# Altium project MB1842.PrjPcb
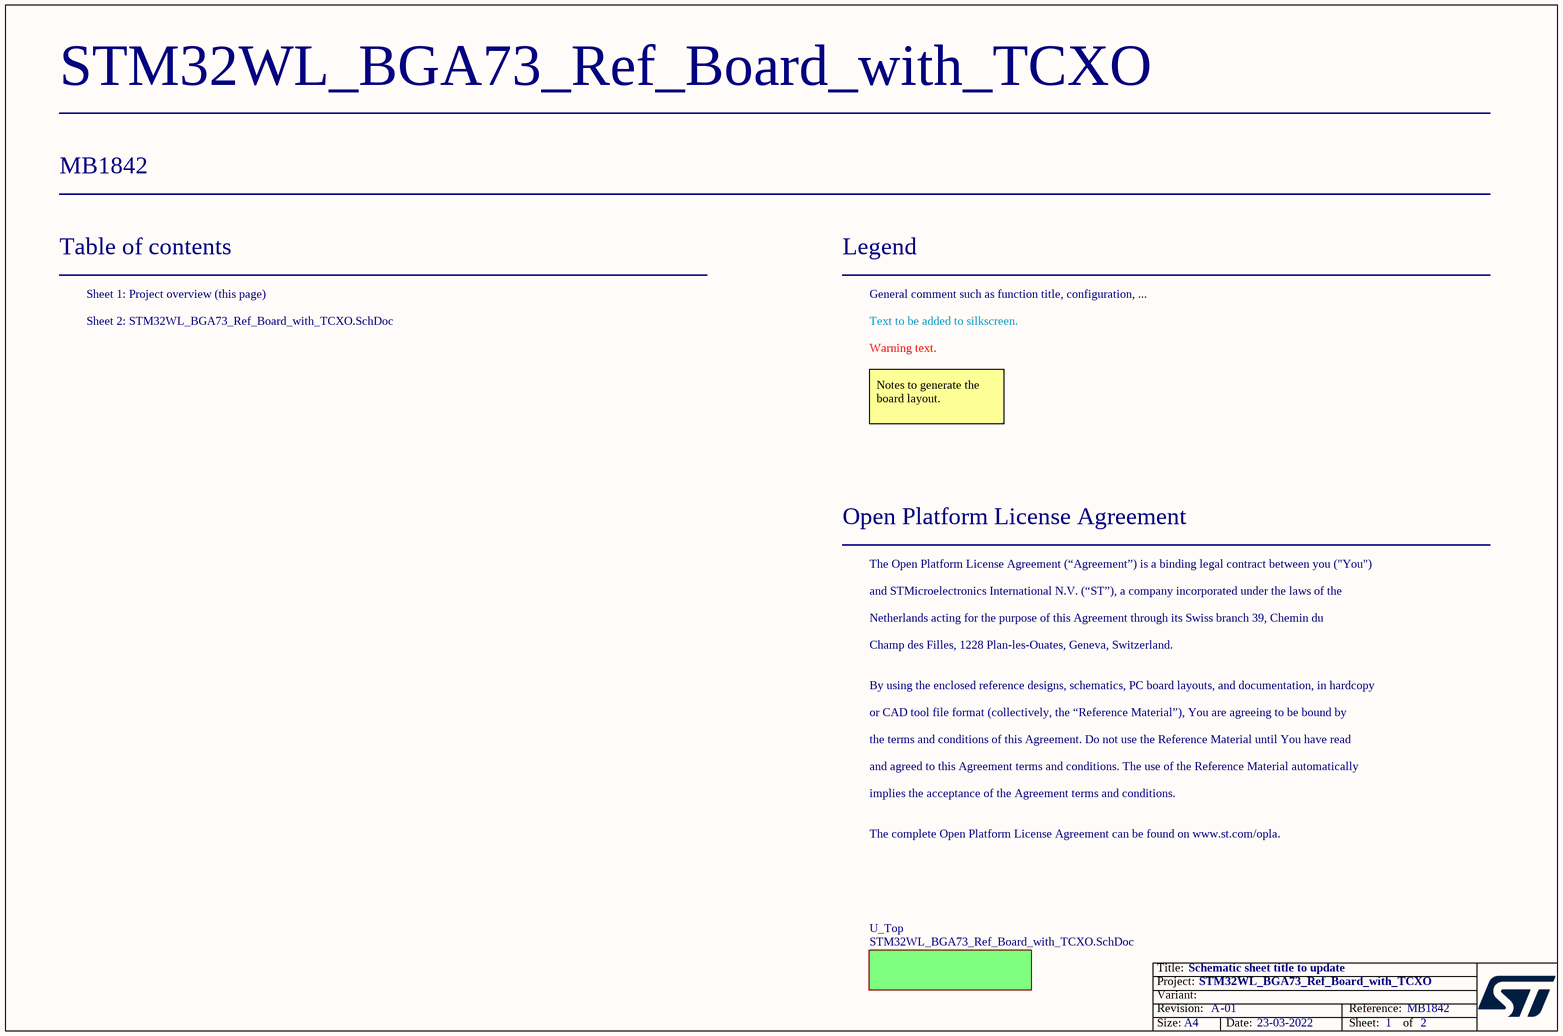
[diagram p0: Project_Overview.SchDoc]
Board_Assembly_Revision: 01; Board_Document_Date: 23-03-2022; Board_Name: STM32WL_BGA73_Ref_Board_with_TCXO; Board_PCB_Revision: A; Board_Reference: MB1842
2 sheets, 78 parts. Net scope: flat (ports and power ports of the same name join across sheets).
Board file: MB1842.PcbDoc
Sheets:
  Project_Overview.SchDoc
    U_Top = STM32WL_BGA73_Ref_Board_with_TCXO.SchDoc

## Sheet Project_Overview.SchDoc: Schematic sheet title to update
size A4; Date: Not used; ApprovedBy: Not used; CheckedBy: Not used; Author: Not used; CompanyName: STMicroelectronics; DrawnBy: Not used; Engineer: Not used; Organization: Not used; Address1: Not used; Address2: Not used; Address3: Not used; Address4: Not used; DocumentNumber: Not used; Revision: Not used; SheetNumber: 1; SheetTotal: 2; CurrentTime: Not used; CurrentDate: Not used; Time: Not used; DocumentFullPathAndName: Not used; DocumentName: Not used; ModifiedDate: Not used; ImagePath: Not used; ProjectName: Not used; Application_BuildNumber: Not used

### Sub-sheets
U_Top = STM32WL_BGA73_Ref_Board_with_TCXO.SchDoc: no entries

### Notes on the sheet
- Table of contents
- Sheet 1: Project overview (this page)
- Legend
- General comment such as function title, configuration, ...
- Sheet 2: STM32WL_BGA73_Ref_Board_with_TCXO.SchDoc
- Text to be added to silkscreen.
- Warning text.
- Notes to generate the board layout.
- Open Platform License Agreement
- The Open Platform License Agreement (“Agreement”) is a binding legal contract between you ("You")
- and STMicroelectronics International N.V. (“ST”), a company incorporated under the laws of the
- Netherlands acting for the purpose of this Agreement through its Swiss branch 39, Chemin du
- Champ des Filles, 1228 Plan-les-Ouates, Geneva, Switzerland.
- By using the enclosed reference designs, schematics, PC board layouts, and documentation, in hardcopy
- or CAD tool file format (collectively, the “Reference Material”), You are agreeing to be bound by
- the terms and conditions of this Agreement. Do not use the Reference Material until You have read
- and agreed to this Agreement terms and conditions. The use of the Reference Material automatically
- implies the acceptance of the Agreement terms and conditions.
- The complete Open Platform License Agreement can be found on www.st.com/opla.
- Title:
- Project:
- Size:
- Revision:
- Variant:
- A4
- -
- Date:
- Reference:
- Sheet:
- of

## Sheet STM32WL_BGA73_Ref_Board_with_TCXO.SchDoc: Schematic sheet title to update
size A3; Date: Not used; ApprovedBy: Not used; CheckedBy: Not used; Author: Not used; CompanyName: STMicroelectronics; DrawnBy: Not used; Engineer: Not used; Organization: Not used; Address1: Not used; Address2: Not used; Address3: Not used; Address4: Not used; DocumentNumber: Not used; Revision: Not used; SheetNumber: 2; SheetTotal: 2; CurrentTime: Not used; CurrentDate: Not used; Time: Not used; DocumentFullPathAndName: Not used; DocumentName: Not used; ModifiedDate: Not used; ImagePath: Not used; ProjectName: Not used; Application_BuildNumber: Not used
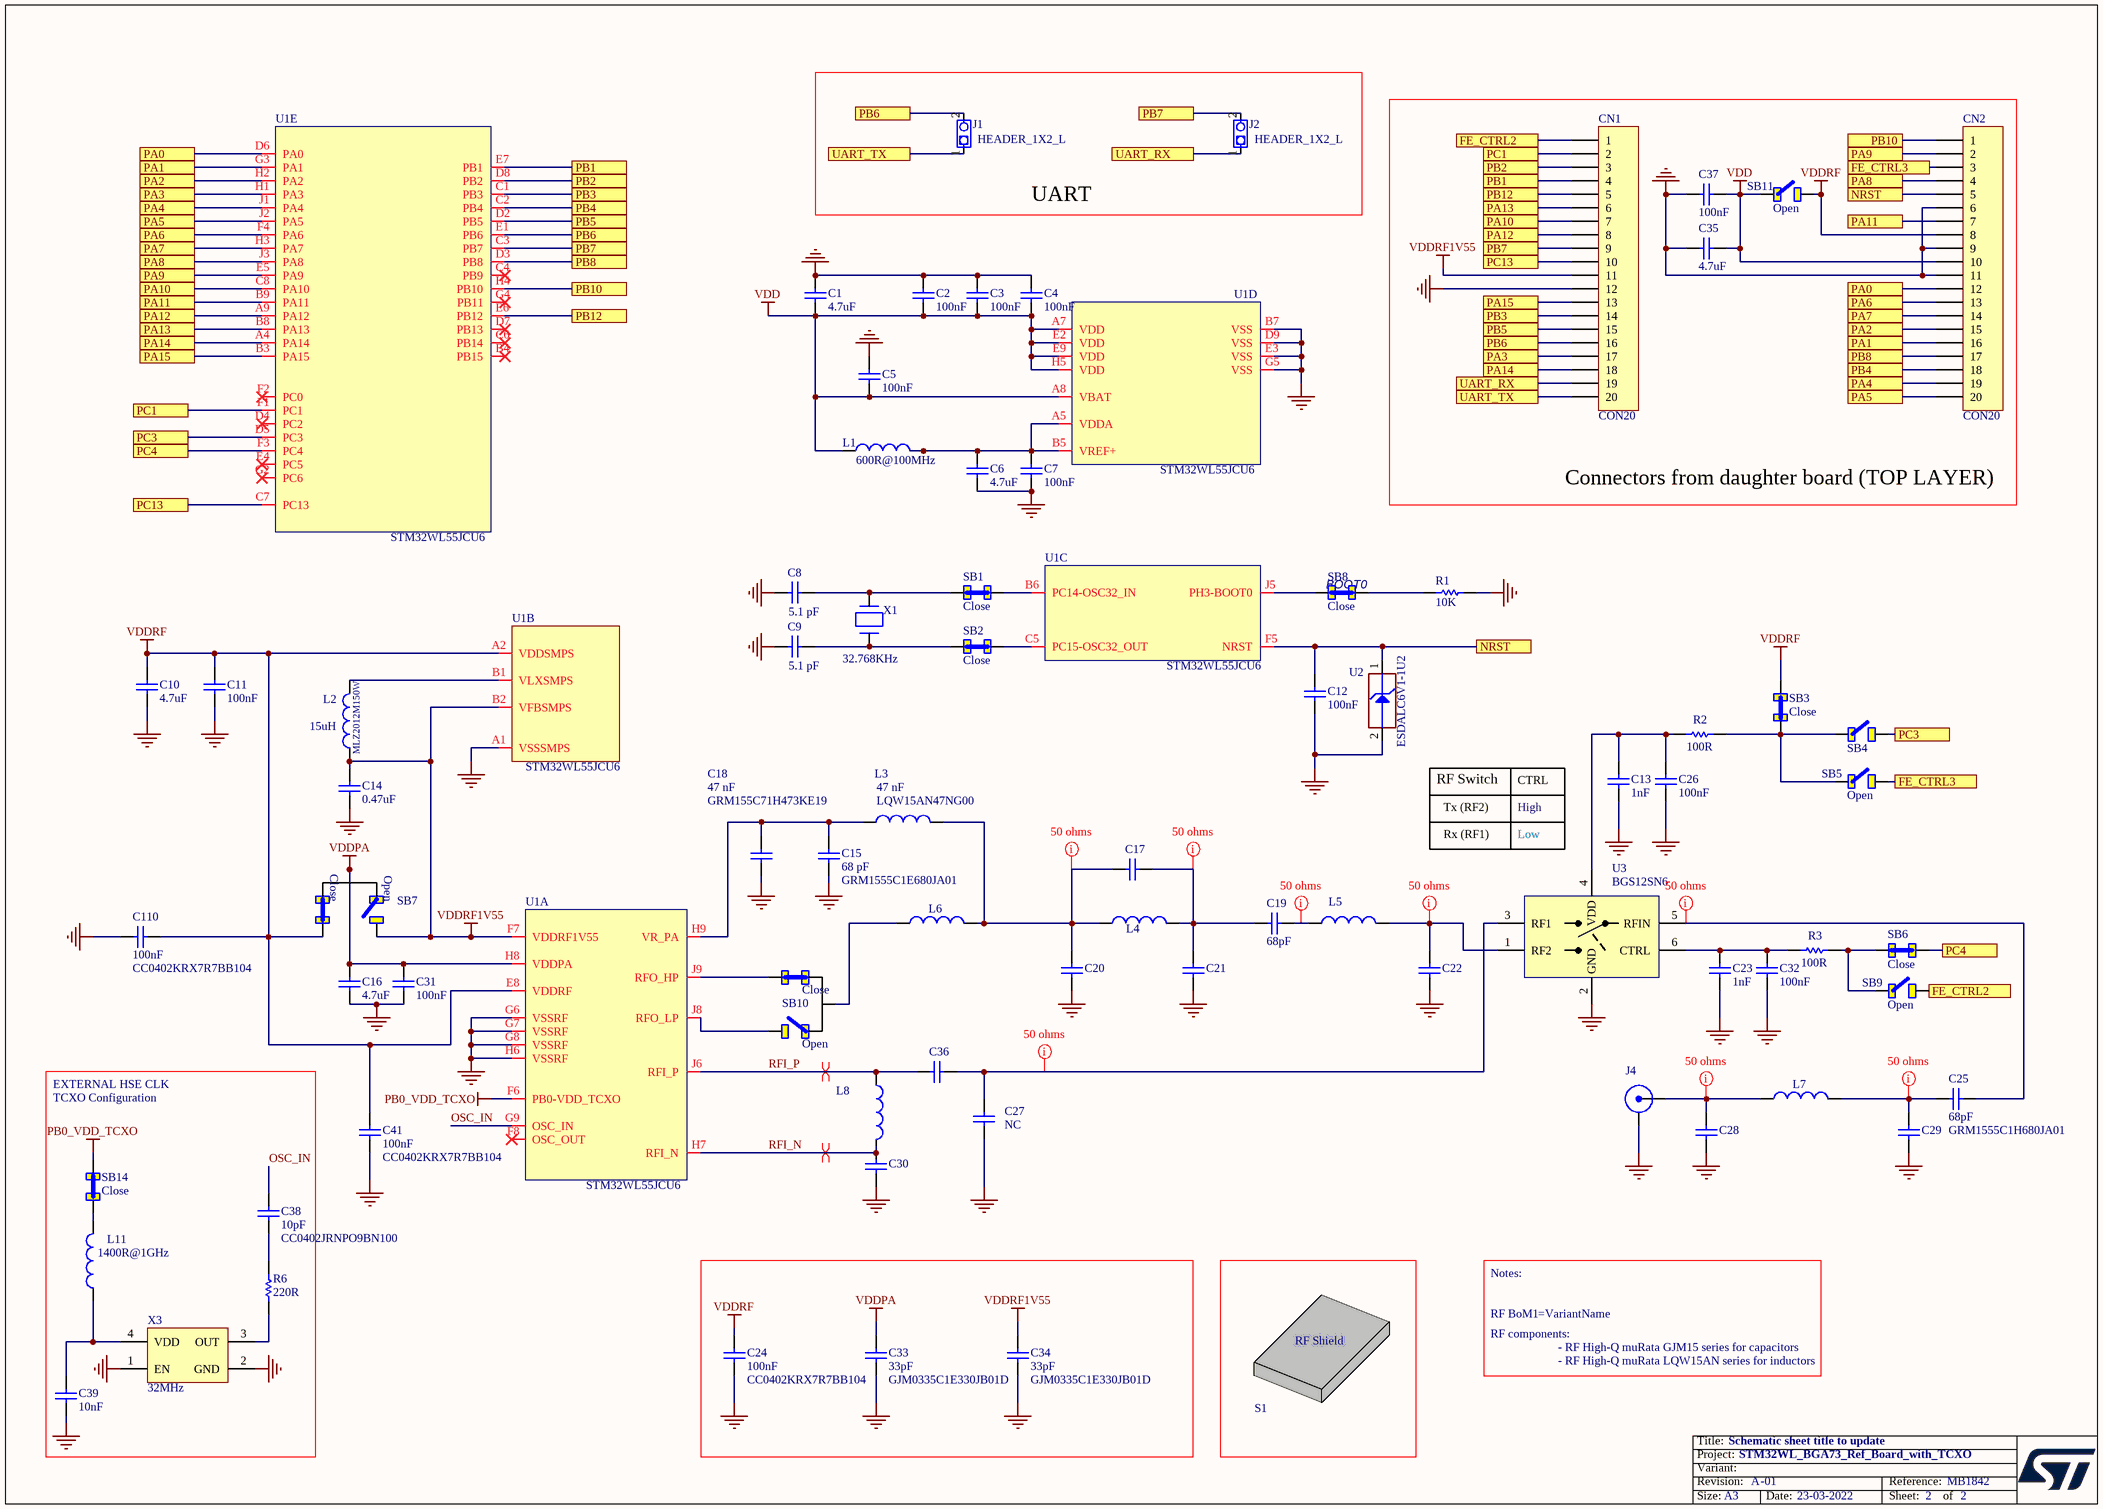
[diagram p1: STM32WL_BGA73_Ref_Board_with_TCXO.SchDoc]

### Parts
C1  value 4.7uF  [CAPC1608X09N]
C2  value 100nF  [CAPC1005X06N]
C3  value 100nF  [CAPC1005X06N]
C4  value 100nF  [CAPC1005X06N]
C5  value 100nF  [CAPC1005X06N]
C6  value 4.7uF  [CAPC1608X09N]
C7  value 100nF  [CAPC1005X06N]
C8  value 5.1 pF  [CAPC1005X06N]  (hidden comment: Capacitor)
C9  value 5.1 pF  [CAPC1005X06N]  (hidden comment: Capacitor)
C10  value 4.7uF  [CAPC1608X09N]
C11  value 100nF  [CAPC1005X06N]
C12  value 100nF  [CAPC1005X06N]
C13  value 1nF  [CAPC1005X06N]
C14  value 0.47uF  [CAPC1608X09N]
C15  value 68 pF  Manufacturer_Part_Number: GRM1555C1E680JA01  [CAPC1005X06N]
C16  value 4.7uF  [CAPC1608X09N]
C17  (no value)  [Capacitor__0402__RF]
C18  value 47 nF  Manufacturer_Part_Number: GRM155C71H473KE19  [CAPC1005X06N]
C19  value 68pF  [Capacitor__0402__RF]
C20  (no value)  [Capacitor__0402__RF]
C21  (no value)  [Capacitor__0402__RF]
C22  (no value)  [Capacitor__0402__RF]
C23  value 1nF  [CAPC1005X06N]
C24  value 100nF  Manufacturer_Part_Number: CC0402KRX7R7BB104  [CAPC1005X06N]
C25  value 68pF  Manufacturer_Part_Number: GRM1555C1H680JA01  [Capacitor__0402__RF]
C26  value 100nF  [CAPC1005X06N]
C27  NC  [Capacitor__0402__RF]
C28  (no value)  [Capacitor__0402__RF]
C29  (no value)  [Capacitor__0402__RF]
C30  (no value)  [Capacitor__0402__RF]
C31  value 100nF  [CAPC1005X06N]
C32  value 100nF  [CAPC1005X06N]
C33  value 33pF  Manufacturer_Part_Number: GJM0335C1E330JB01D  [0201]
C34  value 33pF  Manufacturer_Part_Number: GJM0335C1E330JB01D  [0201]
C35  value 4.7uF  [CAPC1608X09N]
C36  (no value)  [Capacitor__0402__RF]
C37  value 100nF  [CAPC1005X06N]
C38  value 10pF  Manufacturer_Part_Number: CC0402JRNPO9BN100  [C0402]  (hidden comment: Capacitor)
C39  value 10nF  [C0402]
C41  value 100nF  Manufacturer_Part_Number: CC0402KRX7R7BB104  [CAPC1005X06N]
C110  value 100nF  Manufacturer_Part_Number: CC0402KRX7R7BB104  [CAPC1005X06N]
CN1  CON20  [CO_SAMTEC_TSW-120-07-x-S]
CN2  CON20  [CO_SAMTEC_TSW-120-07-x-S]
J1  HEADER_1X2_L  [CO_MOLEX_22-03-2021]
J2  HEADER_1X2_L  [CO_MOLEX_22-03-2021]
J4  Amphenol_132430  [SMA_AMPHENOL_50ohms_Edge_PCB]  (value not drawn)
L1  value 600R@100MHz  [INDC1608X95N]
L2  value 15uH  Manufacturer_Part_Number: MLZ2012M150W  [INDC2012X13N]
L3  value 47 nF  Manufacturer_Part_Number: LQW15AN47NG00  [IND_MURATA_LQW15A]
L4  (no value)  [Inductor__0402__RF]
L5  (no value)  [Inductor__0402__RF]
L6  (no value)  [Inductor__0402__RF]
L7  (no value)  [Inductor__0402__RF]
L8  (no value)  [Inductor__0402__RF]
L11  value 1400R@1GHz  [IND_0402_MURATA_BLM15H_H0P5]
R1  value 10K  [RESC1608X05N]
R2  value 100R  [RESC1005X04N]
R3  value 100R  [RESC1005X04N]
R6  value 220R  [R0402]  (hidden comment: Resistor)
RF_BoM1  RF-BOM  (value not drawn)  (mechanical)
S1  RF-Shield  (value not drawn)
SB1  Close  [SB_0402]
SB2  Close  [SB_0402]
SB3  Close  [SB_0402]
SB4  Open  [SB_0402]  (value not drawn)
SB5  Open  [SB_0402]
SB6  Close  [SB_0402]
SB7  SB_3Pads  [SB3Pads_0402]  (value not drawn)
SB8  Close  [SB_0402]
SB9  Open  [SB_0402]
SB10  SB_3Pads  [SB3Pads_0402]  (value not drawn)
SB11  Open  [SB_0402]
SB14  Close  [SB_0402]
U1  Manufacturer_Part_Number: STM32WL55JCU6  [BGA73C50P9X9_500X500X60]  (parts A,B,C,D,E of 5)
U2  Manufacturer_Part_Number: ESDALC6V1-1U2  [DIOM0603X03N]
U3  BGS12SN6  [SON40P70X40-6N]
X1  value 32.768KHz  [OSC_NDK_NX2012SA]  (hidden comment: XTAL_2_PINS)
X3  value 32MHz  [CRY_NDK_NT2016SB_4P]

### Blocks framed on the sheet
UART: J1 J2
Connectors from daughter board (TOP LAYER): C35 C37 CN1 CN2 SB11

### Ports
FE_CTRL2, FE_CTRL3, NRST, PA0, PA1, PA2, PA3, PA4, PA5, PA6, PA7, PA8, PA9, PA10, PA11, PA12, PA13, PA14, PA15, PB1, PB2, PB3, PB4, PB5, PB6, PB7, PB8, PB10, PB12, PC1, PC3, PC4, PC13, UART_RX, UART_TX

### Nets
GND: C1.1 C2.1 C3.1 C4.1 C5.1 C6.2 C7.2 C8.2 C9.2 C10.2 C11.2 C12.2 C13.1 C14.2 C15.1 C16.2 C18.2 C20.2 C21.1 C22.1 C23.1 C24.2 C26.2 C27.1 C28.2 C29.2 C30.1 C31.2 C32.2 C33.1 C34.1 C35.2 C37.2 C39.1 C41.2 C110.2 CN1.12 CN2.6 CN2.9 CN2.11 J4.2(Y) R1.1 U1.A1(VSSSMPS) U1.B7(VSS) U1.D9(VSS) U1.E3(VSS) U1.G5(VSS) U1.G6(VSSRF) U1.G7(VSSRF) U1.G8(VSSRF) U1.H6(VSSRF) U2.2(GND) U3.2(GND) X3.1(EN) X3.2(GND)
PB0_VDD_TCXO: SB14.2 U1.F6(PB0-VDD_TCXO)
VDD: C1.2 C2.2 C3.2 C4.2 C5.2 C35.1 C37.1 CN2.10 L1.1 SB11.2 U1.A7(VDD) U1.A8(VBAT) U1.E2(VDD) U1.E9(VDD) U1.H5(VDD)
VDDPA: C16.1 C31.1 C33.2 SB7.2 U1.H8(VDDPA)
VDDRF: C10.1 C11.1 C24.1 C41.1 C110.1 CN2.8 SB3.1 SB7.3 SB11.1 U1.A2(VDDSMPS) U1.E8(VDDRF)
VDDRF1V55: C14.1 C34.2 CN1.11 L2.1 SB7.1 U1.B2(VFBSMPS) U1.F7(VDDRF1V55)
OSC_IN: C38.2 U1.G9(OSC_IN)
RFI_N: C30.2 L8.2 U1.H7(RFI_N)
RFI_P: C36.1 L8.1 U1.J6(RFI_P)
NetC6_1: C6.1 C7.1 L1.2 U1.A5(VDDA) U1.B5(VREF+)
NetC8_1: C8.1 SB1.2 X1.2(X2)
NetC9_1: C9.1 SB2.2 X1.1(X1)
NetC12_1: C12.1 CN2.5 U1.F5(NRST) U2.1(IO1) ; port NRST
NetC13_2: C13.2 C26.1 R2.1 U3.4(VDD)
NetC15_2: C15.2 C18.1 L3.2 U1.H9(VR_PA)
NetC17_1: C17.1 C20.1 L3.1 L4.1 L6.1
NetC17_2: C17.2 C19.2 C21.2 L4.2
NetC19_1: C19.1 L5.1
NetC22_2: C22.2 L5.2 U3.1(RF2)
NetC23_2: C23.2 C32.1 R3.1 U3.6(CTRL)
NetC25_1: C25.1 U3.5(RFIN)
NetC25_2: C25.2 C29.1 L7.1
NetC27_2: C27.2 C36.2 U3.3(RF1)
NetC28_1: C28.1 J4.1(X) L7.2
NetC38_1: C38.1 R6.2
NetC39_2: C39.2 L11.1 X3.4(VDD)
NetCN1_1: CN1.1 SB9.1 ; port FE_CTRL2
NetCN1_2: CN1.2 U1.F1(PC1) ; port PC1
NetCN1_3: CN1.3 U1.D8(PB2) ; port PB2
NetCN1_4: CN1.4 U1.E7(PB1) ; port PB1
NetCN1_5: CN1.5 U1.E6(PB12) ; port PB12
NetCN1_6: CN1.6 U1.B8(PA13) ; port PA13
NetCN1_7: CN1.7 U1.C8(PA10) ; port PA10
NetCN1_8: CN1.8 U1.A9(PA12) ; port PA12
NetCN1_9: CN1.9 J2.2 U1.C3(PB7) ; port PB7
NetCN1_10: CN1.10 U1.C7(PC13) ; port PC13
NetCN1_13: CN1.13 U1.B3(PA15) ; port PA15
NetCN1_14: CN1.14 U1.C1(PB3) ; port PB3
NetCN1_15: CN1.15 U1.D2(PB5) ; port PB5
NetCN1_16: CN1.16 J1.2 U1.E1(PB6) ; port PB6
NetCN1_17: CN1.17 U1.H1(PA3) ; port PA3
NetCN1_18: CN1.18 U1.A4(PA14) ; port PA14
NetCN1_19: CN1.19 J2.1 ; port UART_RX
NetCN1_20: CN1.20 J1.1 ; port UART_TX
NetCN2_1: CN2.1 U1.H4(PB10) ; port PB10
NetCN2_2: CN2.2 U1.E5(PA9) ; port PA9
NetCN2_3: CN2.3 SB5.1 ; port FE_CTRL3
NetCN2_4: CN2.4 U1.J3(PA8) ; port PA8
NetCN2_7: CN2.7 U1.B9(PA11) ; port PA11
NetCN2_12: CN2.12 U1.D6(PA0) ; port PA0
NetCN2_13: CN2.13 U1.F4(PA6) ; port PA6
NetCN2_14: CN2.14 U1.H3(PA7) ; port PA7
NetCN2_15: CN2.15 U1.H2(PA2) ; port PA2
NetCN2_16: CN2.16 U1.G3(PA1) ; port PA1
NetCN2_17: CN2.17 U1.D3(PB8) ; port PB8
NetCN2_18: CN2.18 U1.C2(PB4) ; port PB4
NetCN2_19: CN2.19 U1.J1(PA4) ; port PA4
NetCN2_20: CN2.20 U1.J2(PA5) ; port PA5
NetL2_2: L2.2 U1.B1(VLXSMPS)
NetL6_2: L6.2 SB10.2
NetL11_2: L11.2 SB14.1
NetR1_2: R1.2 SB8.1
NetR2_2: R2.2 SB3.2 SB4.2 SB5.2
NetR3_2: R3.2 SB6.2 SB9.2
NetR6_1: R6.1 X3.3(OUT)
NetSB1_1: SB1.1 U1.B6(PC14-OSC32_IN)
NetSB2_1: SB2.1 U1.C5(PC15-OSC32_OUT)
NetSB4_1: SB4.1 U1.D5(PC3) ; port PC3
NetSB6_1: SB6.1 U1.F3(PC4) ; port PC4
NetSB8_2: SB8.2 U1.J5(PH3-BOOT0)
NetSB10_1: SB10.1 U1.J8(RFO_LP)
NetSB10_3: SB10.3 U1.J9(RFO_HP)

Not connected (* = marked no-connect by the designer): U1 B4(PB15)* C4(PB9)* C6(PB14)* D4(PC2)* D7(PB13)* E4(PC5)* F2(PC0)* F8(OSC_OUT)* G2(PC6)* G4(PB11)*

### Layout directives
differential pair: RFI_N, RFI_P
net class 50Ohms: NetC17_1, NetC17_2, NetC19_1, NetC22_2, NetC25_1, NetC25_2, NetC27_2, NetC28_1

### Notes on the sheet
- (near SB8) BOOT0
- RF Switch
- CTRL
- Tx (RF2)
- Rx (RF1)
- Low
- High
- TCXO Configuration
- EXTERNAL HSE CLK
- Notes:
- RF components:
- (near RF_BoM1) - RF High-Q muRata GJM15 series for capacitors
- (near RF_BoM1) - RF High-Q muRata LQW15AN series for inductors
- Title:
- Project:
- Size:
- Revision:
- Variant:
- A3
- -
- Date:
- Reference:
- Sheet:
- of
- (in symbol RF-Shield) RF Shield
- (in symbol SB_3Pads) Close; Open

### Library data of the parts
C1 C6 C10 C16 C35 = MCD-00009: Capacitor, MLCC, 4.7uF, 16V, X5R, 10%, 0603, T=0.8mm; Manufacturer_Part_Number: CC0603KRX5R7BB475; Manufacturer: YAGEO; Package: C0603
C2-C5 C7 C11 C12 C26 C31 C32 C37 = MCD-00102: Capacitor, MLCC, 100nF, 16V, X7R, 10%, 0402, T=0,5mm; Manufacturer_Part_Number: CC0402KRX7R7BB104; Manufacturer: YAGEO; Package: C0402
C8 C9 = MCD-00003: Capacitor, MLCC, 5.1 pF, 50V, NPO, +-0.1pF, 0402, T=0.5mm; Manufacturer_Part_Number: CC0402CRNPO9BN5R1; Manufacturer: YAGEO
C13 C23 = MCD-00198: Capacitor, MLCC, 1nF, 16V, X7R, 10%, 0402, T=0.5mm; Manufacturer_Part_Number: CC0402KRX7R7BB102; Manufacturer: YAGEO
C14 = MCD-00009: Multilayer Ceramic Capacitors MLCC - SMD/SMT 16V 0.47uF X5R 0603 10%; Manufacturer_Part_Number: CC0603KRX5R7BB474; Manufacturer: YAGEO; Package: C0603
C15 C25 = MCD-01123: Capacitor, MLCC,68pF, 50V, C0G, 1%, 0402, T=0.5mm; Manufacturer: MURATA
C17 C22 = MCD-01123: RF Capacitor
C18 = MCD-01123: Capacitor, MLCC,47nF, 16V, X7R, 10%, 0402, T=0.5mm; Manufacturer: MURATA
C19 = MCD-01123: Capacitor, MLCC,68pF, 50V, C0G, 1%, 0402, T=0.5mm; Manufacturer_Part_Number: GRM1555C1H680JA01; Manufacturer: MURATA
C20 C28 C29 = MCD-00102: RF Capacitor; Package: C0402
C21 = MCD-00015: RF Capacitor
C24 C41 C110 = MCD-00102: Capacitor, MLCC, 100nF, 16V, X7R, 10%, 0402, T=0,5mm; Manufacturer: YAGEO; Package: C0402
C27 = MCD-01123: Manufacturer_Part_Number: Not Fitted; Manufacturer: Not Fitted
C30 C36 = MCD-01123
C33 C34 = MCD-00277: Multilayer Ceramic Capacitors MLCC - SMD/SMT 0201 33pF 25volts C0G 5%; Manufacturer: MURATA
C38 = MCD-00015: Capacitor, MLCC, 10pF, 50V, NPO, +/-5%, 0402, T=0,5mm; Part_Preference: Recommended; Manufacturer: YAGEO; Internal_Part_Number: MCD-00015; Status: Released; Part_Type: Capacitor; Package: C0402; ComponentLink1Description: Datasheet; ComponentLink1URL: http://tunmcdsvn.tun.st.com/Component_Datasheet_Library/Trunk/Capacitors/Yageo_Capacitor_NP0_16V-to-50V
C39 = MCD-00011: Capacitor, MLCC, 10nF, 16V, X7R, 10%, 0402, T=0.5mm; Manufacturer_Part_Number: CC0402KRX7R7BB103; Manufacturer: YAGEO; Provided_By: SUBCO; ECCN_US: EAR99; ECCN_EU: NEC; Internal_Part_Number: MCD-00011; Status: Released; Part_Type: Capacitor; Package: C0402; ComponentLink1Description: Datasheet; ComponentLink1URL: http://tunmcdsvn.tun.st.com/Component_Datasheet_Library/Trunk/Capacitors/Yageo_Multilayer_Capacitor_X7R_series_100pF_to_22uF
CN1 CN2 = CON20: Connector right-angle, pitch 2.54mm, 20 contacts; Manufacturer: SAMTEC; Manufacturer_Part_Number: TSW-120-07-L-S
J1 J2 = HEADER_1X2_L: Header 1x2 Through hole 2.54mm; Manufacturer: MOLEX; Manufacturer_Part_Number: 22-03-2021
J4 = SMA_thickness_1.19mm_AMPHENOL: RF Connector, SMA End Launch Jack for 0.047 inch PCB, 50 Ohm, Flat Tab Contact; Manufacturer_Part_Number: 132430; Manufacturer: AMPHENOL
L1 = MCD-00047: Ferrite Beads 0603 600 OHM; Manufacturer_Part_Number: BLM18AG601SN1D; Manufacturer: MURATA
L2 = MCD-01433: MLZ2012 Multilayer Shielded Inductor 15µH, ±5%; Manufacturer: TDK
L3 = MCD-01330: RF Inductor; Manufacturer: MURATA
L4-L7 = MCD-01330: RF Inductor
L8 = MCD-01330
L11 = MCD-01610: ferrite bead, 1400ohms at 1GHz, 250mA, 1.1ohms DC max; Manufacturer_Part_Number: BLM15HG102SN1#; Manufacturer: MURATA; Provided_By: SUBCO; Internal_Part_Number: MCD-01610; Status: Footprint available; Part_Type: Inductor; Package: L0402; ComponentLink1Description: Datasheet; ComponentLink1URL: http://tunmcdsvn.tun.st.com/Component_Datasheet_Library/Trunk/Inductors/Murata_ferrite-bead_BLM15series; ECCN_US: n/a; ECCN_EU: n/a
R1 = MCD-00220: Resistor,10K,0603,1%,1/10W; Manufacturer_Part_Number: RC0603FR-0710KL; Manufacturer: YAGEO
R2 R3 = MCD-00119: Resistor,100R,0402,1%,1/16W; Manufacturer_Part_Number: RC0402FR-07100RL; Manufacturer: YAGEO
R6 = MCD-00427: Resistor,220R,0402,1%,1/16W; Manufacturer_Part_Number: RC0402FR-07220RL; Manufacturer: YAGEO; ECCN_US: EAR99; ECCN_EU: NEC; Provided_By: SUBCO; Internal_Part_Number: MCD-00427; Status: Released; Part_Type: Resistor; Package: R0402; ComponentLink1Description: Datasheet; ComponentLink1URL: http://tunmcdsvn.tun.st.com/Component_Datasheet_Library/Trunk/Resistors/Yageo_Resistor_RC0402-series
S1 = RF-Shield: RF Shield Frame + Cover without apertures; Manufacturer: Masach Tech; Manufacturer_Part_Number: MS409-10
SB1 SB2 SB8 = SB_0Ohm: Solder Bridge 0R [0402] (Populated with 0 Ohm); Manufacturer: Vishay / Dale; Manufacturer_Part_Number: RCS04020000Z0ED; Revision: July-2002: Re-released for DXP Platform.
SB3 = SB_0Ohm: Solder Bridge 0R [0402] (Populated with 0 ohm); Manufacturer: Vishay / Dale; Manufacturer_Part_Number: RCS04020000Z0ED; Revision: July-2002: Re-released for DXP Platform.
SB4 = SB_Open: Solder Bridge Open [0402] (Unpopulated); Manufacturer: NOT FITTED; Revision: July-2002: Re-released for DXP Platform.; Manufacturer_Part_Number: NOT FITTED
SB5 SB9 SB11 = SB_Open: Solder Bridge Open [0402] (Unpopulated); Revision: July-2002: Re-released for DXP Platform.
SB6 = SB_0Ohm: Solder Bridge 0R [0402] (Populated with 0 ohm); Manufacturer: Vishay / Dale; Manufacturer_Part_Number: RCS04020000Z0ED; VALUE: 0; Revision: July-2002: Re-released for DXP Platform.
SB7 SB10 = SB_3Pads: Solder Bridge Open [0402] (Unpopulated); Manufacturer: NOT FITTED; Revision: July-2002: Re-released for DXP Platform.; Manufacturer_Part_Number: NOT FITTED
SB14 = SB_0Ohm: Solder Bridge 0R [0402] (Populated with 0 Ohm); Manufacturer: Vishay / Dale; Manufacturer_Part_Number: RCS04020000Z0ED; VALUE: 0; Revision: July-2002: Re-released for DXP Platform.
U1 = MCD-01435: Multiprotocol Wireless 32-bit MCUwith LPWAN Sub-GHz radio solution; Manufacturer: STMICROELECTRONICS
U2 = MCD-00170: ESD protection 6V1; Manufacturer: STMICROELECTRONICS
U3 = BGS12SN6: DC switch - Ultra-Low  SPDT analog switch; Manufacturer: INFINEON; Manufacturer_Part_Number: BGS12SN6
X1 = MCD-01479: Crystal 32.768kHz, 6pF, -+20PPM, R=80K, SMD; Manufacturer_Part_Number: NX2012SA 32.768KHz EXS00A-MU00527; Manufacturer: NDK
X3 = MCD-01492: NT2016SA-32M-END4263A; Part_Type: Crystal_Osc; Manufacturer: NDK; Provided_By: SUBCO; ECCN_US: EAR99; ECCN_EU: NEC; Internal_Part_Number: MCD-01492; Status: Checked; Manufacturer_Part_Number: NT2016SA-32M-END4263A; Package: 2016 size; ComponentLink1Description: Datasheet; ComponentLink1URL: http://tunmcdsvn.tun.st.com/Component_Datasheet_Library/Trunk/Crystal_Osc/NDK_NT2016SA

## Assembly variants
LowBand_HighPower: not fitted C20; alternate parts L6 -> MCD-01330
HighBand_LowPower: not fitted C28 C29; alternate parts SB10 -> SB_3Pads_HP, SB7 -> SB_3Pads_HP
HighBand_HighPower: alternate parts SB10 -> SB_3Pads_LP